# EAGLE design shield (EAGLE 9.5.1)
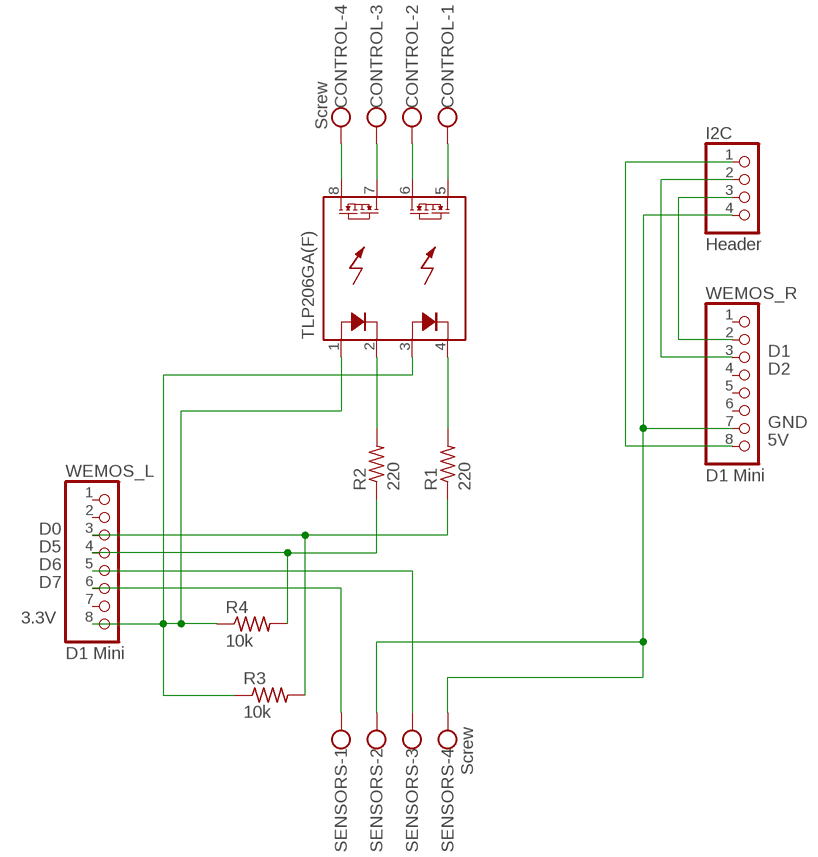
[diagram p0: schematic, sheet 1]

## Parts
CONTROL  Screw  AK550/4QUIET  [AK500/4-N]
I2C  Header  PINHD-1X4/OCT  [1X04/OCT]
R1  220  R-US_R0603  [R0603]
R2  220  R-US_R0603  [R0603]
R3  10k  R-US_R0603  [R0603]
R4  10k  R-US_R0603  [R0603]
SENSORS  Screw  AK550/4QUIET  [AK500/4-N]
TLP206GA(F)  TLP206A  [SOP08]
WEMOS_L  D1 Mini  PINHD-1X8/OCT  [1X08/OCT]
WEMOS_R  D1 Mini  PINHD-1X8/OCT  [1X08/OCT]

## Nets
3.3V: R3.1 R4.1 TLP206GA(F).1(LED(+)_1) TLP206GA(F).3(LED(+)_2) WEMOS_L.8
5V: I2C.1 WEMOS_R.8
D0: R1.1 R3.2 WEMOS_L.3
D1: I2C.2 WEMOS_R.3
D2: I2C.3 WEMOS_R.2
D5: R2.1 R4.2 WEMOS_L.4
D6: SENSORS.3 WEMOS_L.5
D7: SENSORS.1 WEMOS_L.6
GND: I2C.4 SENSORS.2 SENSORS.4 WEMOS_R.7
N$1: CONTROL.1 TLP206GA(F).5(RELAY2_1)
N$2: CONTROL.3 TLP206GA(F).7(RELAY1_1)
N$3: CONTROL.2 TLP206GA(F).6(RELAY2_2)
N$4: R2.2 TLP206GA(F).2(LED(-)_1)
N$5: CONTROL.4 TLP206GA(F).8(RELAY1_2)
N$6: R1.2 TLP206GA(F).4(LED(-)_2)
Unconnected: WEMOS_L.1 WEMOS_L.2 WEMOS_L.7 WEMOS_R.1 WEMOS_R.4 WEMOS_R.5 WEMOS_R.6

## Library data of the parts
CONTROL SENSORS = shield:AK550/4: CONNECTOR
I2C = pinhead_v2:PINHD-1X4: PIN HEADER
R1-R4 = resistor:R-US_: RESISTOR, American symbol
TLP206GA(F) = shield:TLP206A; MPN: TLP206GA(F)
WEMOS_L WEMOS_R = pinhead_v2:PINHD-1X8: PIN HEADER

## Board
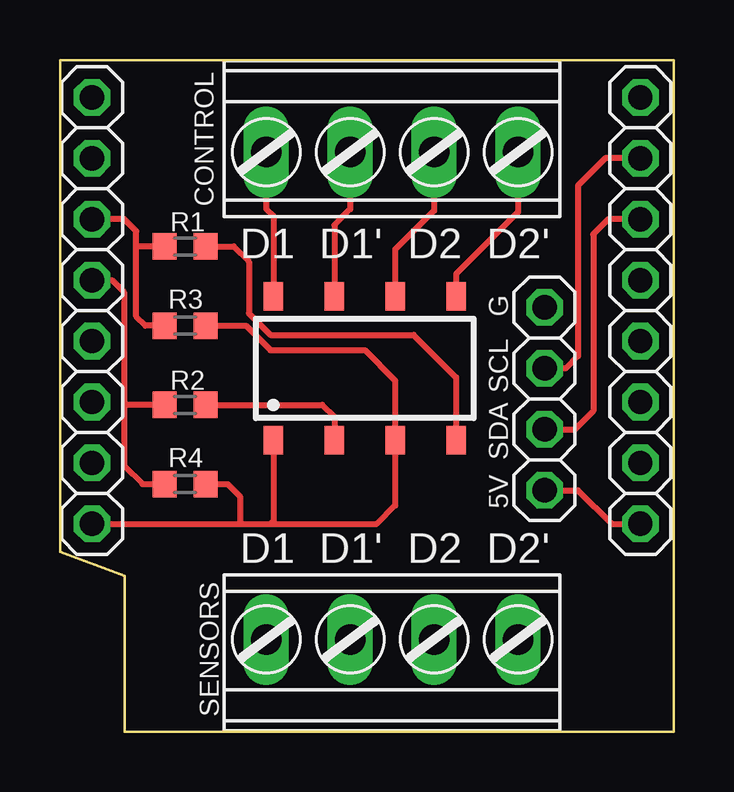
[diagram p1: board, top side]
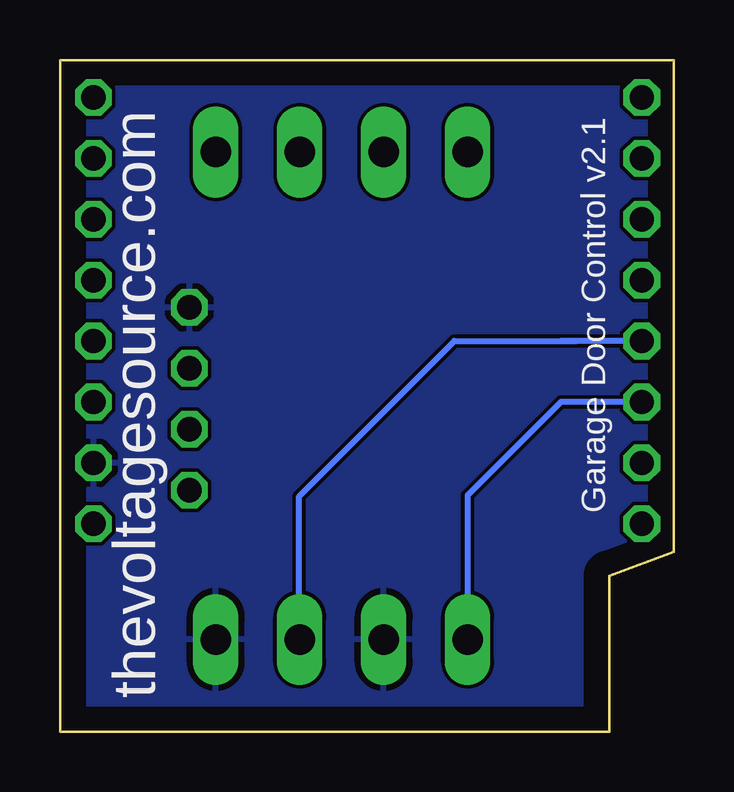
[diagram p2: board, bottom side, seen from below]

Size 25.6 x 28 mm. Coordinates in mm from the lower left corner, seen from the top.
Outline: 0,7.5 0,28 25.6,28 25.6,0 2.7,0 2.7,6.5 0,7.5
Copper layers (1*16): Top 0.035mm / dielectric 1.5mm / Bottom 0.035mm
Design rules "default": minimum track width 6mil, minimum drill 0.35mm, track to track 6mil, track to pad 6mil, pad to pad 6mil, via to via 6mil, smd to smd 6mil, copper to edge 40mil, drill to drill 6mil, minimum pad ring 10mil, minimum via ring 8mil, stop-mask expansion 4mil, vias tented up to drill 0mil, thermal gap 10mil

### Footprints (pad centres in the part's own frame; a part is rotated, then mirrored left to right if it is on the bottom)
AK500/4-N = drill 1.27 long: 1 -5.25,0; 2 -1.75,0; 3 1.75,0; 4 5.25,0
1X04/OCT = drill 1.016 octagon: 1 -3.81,0; 2 -1.27,0; 3 1.27,0; 4 3.81,0
R0603 = smd 1 x 1.1: 1 -0.85,0; 2 0.85,0
SOP08 = smd 0.8 x 1.2: 1 -3.81,-3; 2 -1.27,-3; 3 1.27,-3; 4 3.81,-3; 5 3.81,3; 6 1.27,3; 7 -1.27,3; 8 -3.81,3
1X08/OCT = drill 1.016 octagon: 1 -8.89,0; 2 -6.35,0; 3 -3.81,0; 4 -1.27,0; 5 1.27,0; 6 3.81,0; 7 6.35,0; 8 8.89,0

### Placement (x,y rotation side)
CONTROL  13.85,24.16 180 top
I2C  20.2,13.87 90 top
R1  5.22,20.22 0 top
R2  5.22,13.62 0 top
R3  5.22,16.92 180 top
R4  5.22,10.32 180 top
SENSORS  13.85,3.84 0 top
TLP206GA(F)  12.71,15.14 0 top
WEMOS_L  1.34,17.55 270 top
WEMOS_R  24.2,17.55 270 top

### Tracks (layer width: path | path; a pad name or v marks a point on that pad's centre or on a via)
3.3V
  Top 0.254: R4.1 6.99,10.32 7.5,9.81 7.5,8.66 | R3.1 7.76,16.92 8.77,15.9 12.71,15.9 13.98,14.63 TLP206GA(F).3 13.98,9.42 13.22,8.66 8.77,8.66 | WEMOS_L.8 7.5,8.66 | 7.5,8.66 8.77,8.66 | TLP206GA(F).1 8.9,8.79 8.77,8.66
5V
  Top 0.254: I2C.1 21.6,10.06 23,8.66 WEMOS_R.8
D0
  Top 0.254: R3.2 3.57,16.92 3.18,17.3 3.18,20.22 | WEMOS_L.3 2.68,21.37 3.18,20.86 3.18,20.22 | R1.1 3.18,20.22
D1
  Top 0.254: I2C.2 21.47,12.6 22.23,13.36 22.23,20.73 22.86,21.36 WEMOS_R.3
D2
  Top 0.254: WEMOS_R.2 22.74,23.9 21.6,22.76 21.6,15.65 21.09,15.14 I2C.3
D5
  Top 0.254: WEMOS_L.4 2.17,18.82 2.68,18.32 2.68,13.62 | R2.1 2.68,13.62 | R4.2 3.44,10.32 2.68,11.08 2.68,13.62
D6
  Bottom 0.254: WEMOS_L.5 4.07,16.28 | 4.07,16.28 4.7,16.28 4.71,16.29 | SENSORS.3 15.63,3.87 15.63,9.81 9.15,16.29 4.08,16.29 4.07,16.28
D7
  Bottom 0.254: WEMOS_L.6 4.71,13.74 8.6,9.85 SENSORS.1
GND
  pour Bottom: 0.45,27.58 25.34,27.58 25.34,0.28 3.12,0.28 2.99,0.4 2.99,6.5 2.23,7.26 1.59,7.26 1.34,7.52 1.09,7.52 0.71,7.9 0.45,7.9
N$1
  Top 0.254: CONTROL.1 19.1,21.66 16.52,19.08 TLP206GA(F).5
N$2
  Top 0.254: CONTROL.3 12.1,21.77 11.44,21.11 TLP206GA(F).7
N$3
  Top 0.254: CONTROL.2 15.6,21.72 13.98,20.1 TLP206GA(F).6
N$4
  Top 0.254: R2.2 10.93,13.62 11.44,13.11 TLP206GA(F).2
N$5
  Top 0.254: 8.6,18.44 TLP206GA(F).8 8.9,21.49 8.6,21.79 CONTROL.4
N$6
  Top 0.254: R1.2 7.25,20.22 7.88,19.59 7.88,17.43 8.77,16.54 14.74,16.54 16.52,14.76 TLP206GA(F).4

### Text on the board
tNames: D1 | D1' | D2 | D2' | G | SCL | SDA | 5V | D1 | D1' | D2 | D2'
bNames: Garage Door Control v2.1 | thevoltagesource.com